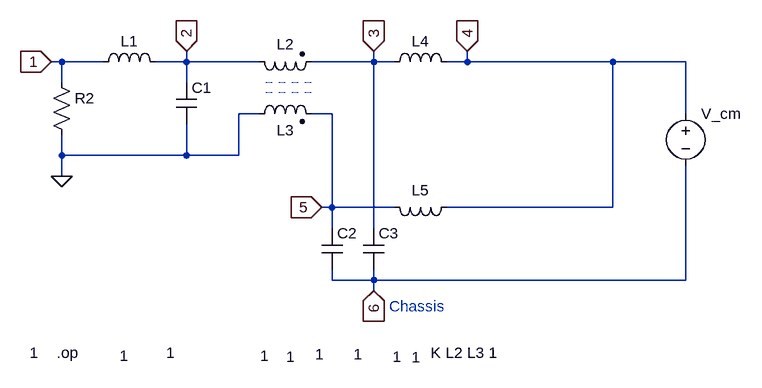
[diagram p0: schematic mathematical_analysis_of_a_combined_filter_v1_CM.asc]
mathematical_analysis_of_a_combined_filter_v1_CM.asc, the LTspice schematic file:
Version 4
SHEET 1 1068 680
WIRE -96 80 -112 80
WIRE -32 80 -96 80
WIRE 96 80 96 64
WIRE 96 80 48 80
WIRE 208 80 96 80
WIRE 384 80 384 64
WIRE 384 80 288 80
WIRE 416 80 384 80
WIRE 528 80 528 64
WIRE 528 80 496 80
WIRE 752 80 528 80
WIRE 864 80 752 80
WIRE -96 112 -96 80
WIRE 96 112 96 80
WIRE 208 160 176 160
WIRE 320 160 288 160
WIRE 864 160 864 80
WIRE -96 224 -96 192
WIRE 96 224 96 176
WIRE 96 224 -96 224
WIRE 176 224 176 160
WIRE 176 224 96 224
WIRE -96 256 -96 224
WIRE 320 304 320 160
WIRE 320 304 304 304
WIRE 416 304 320 304
WIRE 752 304 752 80
WIRE 752 304 496 304
WIRE 320 336 320 304
WIRE 384 336 384 80
WIRE 320 416 320 400
WIRE 384 416 384 400
WIRE 384 416 320 416
WIRE 864 416 864 240
WIRE 864 416 384 416
WIRE 384 432 384 416
FLAG -96 256 0
FLAG -112 80 1
IOPIN -112 80 In
FLAG 96 64 2
IOPIN 96 64 In
FLAG 304 304 5
IOPIN 304 304 In
FLAG 384 64 3
IOPIN 384 64 In
FLAG 528 64 4
IOPIN 528 64 In
FLAG 384 432 6
IOPIN 384 432 In
SYMBOL ind -48 96 R270
WINDOW 0 32 56 VTop 2
WINDOW 3 -421 48 VBottom 2
SYMATTR InstName L1
SYMATTR Value 1
SYMBOL ind2 192 64 M90
WINDOW 0 5 56 VBottom 2
WINDOW 3 453 24 VTop 2
SYMATTR InstName L2
SYMATTR Value 1
SYMATTR Type ind
SYMBOL ind2 192 176 R270
WINDOW 0 -25 56 VTop 2
WINDOW 3 -342 64 VBottom 2
SYMATTR InstName L3
SYMATTR Value 1
SYMATTR Type ind
SYMBOL ind 400 96 R270
WINDOW 0 32 56 VTop 2
WINDOW 3 -423 49 VBottom 2
SYMATTR InstName L4
SYMATTR Value 1
SYMBOL ind 512 288 R90
WINDOW 0 5 56 VBottom 2
WINDOW 3 230 92 VTop 2
SYMATTR InstName L5
SYMATTR Value 1
SYMBOL cap 80 112 R0
WINDOW 3 -15 416 Left 2
SYMATTR Value 1
SYMATTR InstName C1
SYMBOL cap 304 336 R0
WINDOW 3 -10 194 Left 2
SYMATTR Value 1
SYMATTR InstName C2
SYMBOL cap 368 336 R0
WINDOW 3 -15 194 Left 2
SYMATTR Value 1
SYMATTR InstName C3
SYMBOL voltage 864 144 R0
WINDOW 3 24 96 Invisible 2
WINDOW 123 0 0 Left 0
WINDOW 39 0 0 Left 0
SYMATTR Value 1
SYMATTR InstName V_cm
SYMBOL res -112 96 R0
WINDOW 3 -33 432 Left 2
SYMATTR Value 1
SYMATTR InstName R2
TEXT 472 528 Left 2 !K L2 L3 1
TEXT -104 528 Left 2 !.op
TEXT 408 456 Left 2 ;Chassis
LINE Normal 288 112 208 112 2
LINE Normal 288 112 288 112 2
LINE Normal 288 112 288 112 2
LINE Normal 288 112 288 112 2
LINE Normal 288 112 288 112 2
LINE Normal 288 112 288 112 2
LINE Normal 288 128 208 128 2
LINE Normal 288 128 288 128 2
LINE Normal 288 128 288 128 2
LINE Normal 288 128 288 128 2

The netlist it stands for:
* mathematical_analysis_of_a_combined_filter_v1_CM.asc
L1 1 2 1
L2 2 3 1
L3 0 5 1
L4 3 4 1
L5 4 5 1
C1 2 0 1
C2 5 6 1
C3 3 6 1
V_cm 4 6 1
R2 1 0 1
K L2 L3 1
.op
* Chassis
.backanno
.end